# EAGLE design Domino JTAG SPI No Teardrop (EAGLE 6.5.0)
DATABASE: ./../Common/BOM/Domino_DB.txt; DRAWN: M.STEMPIN; REV: D
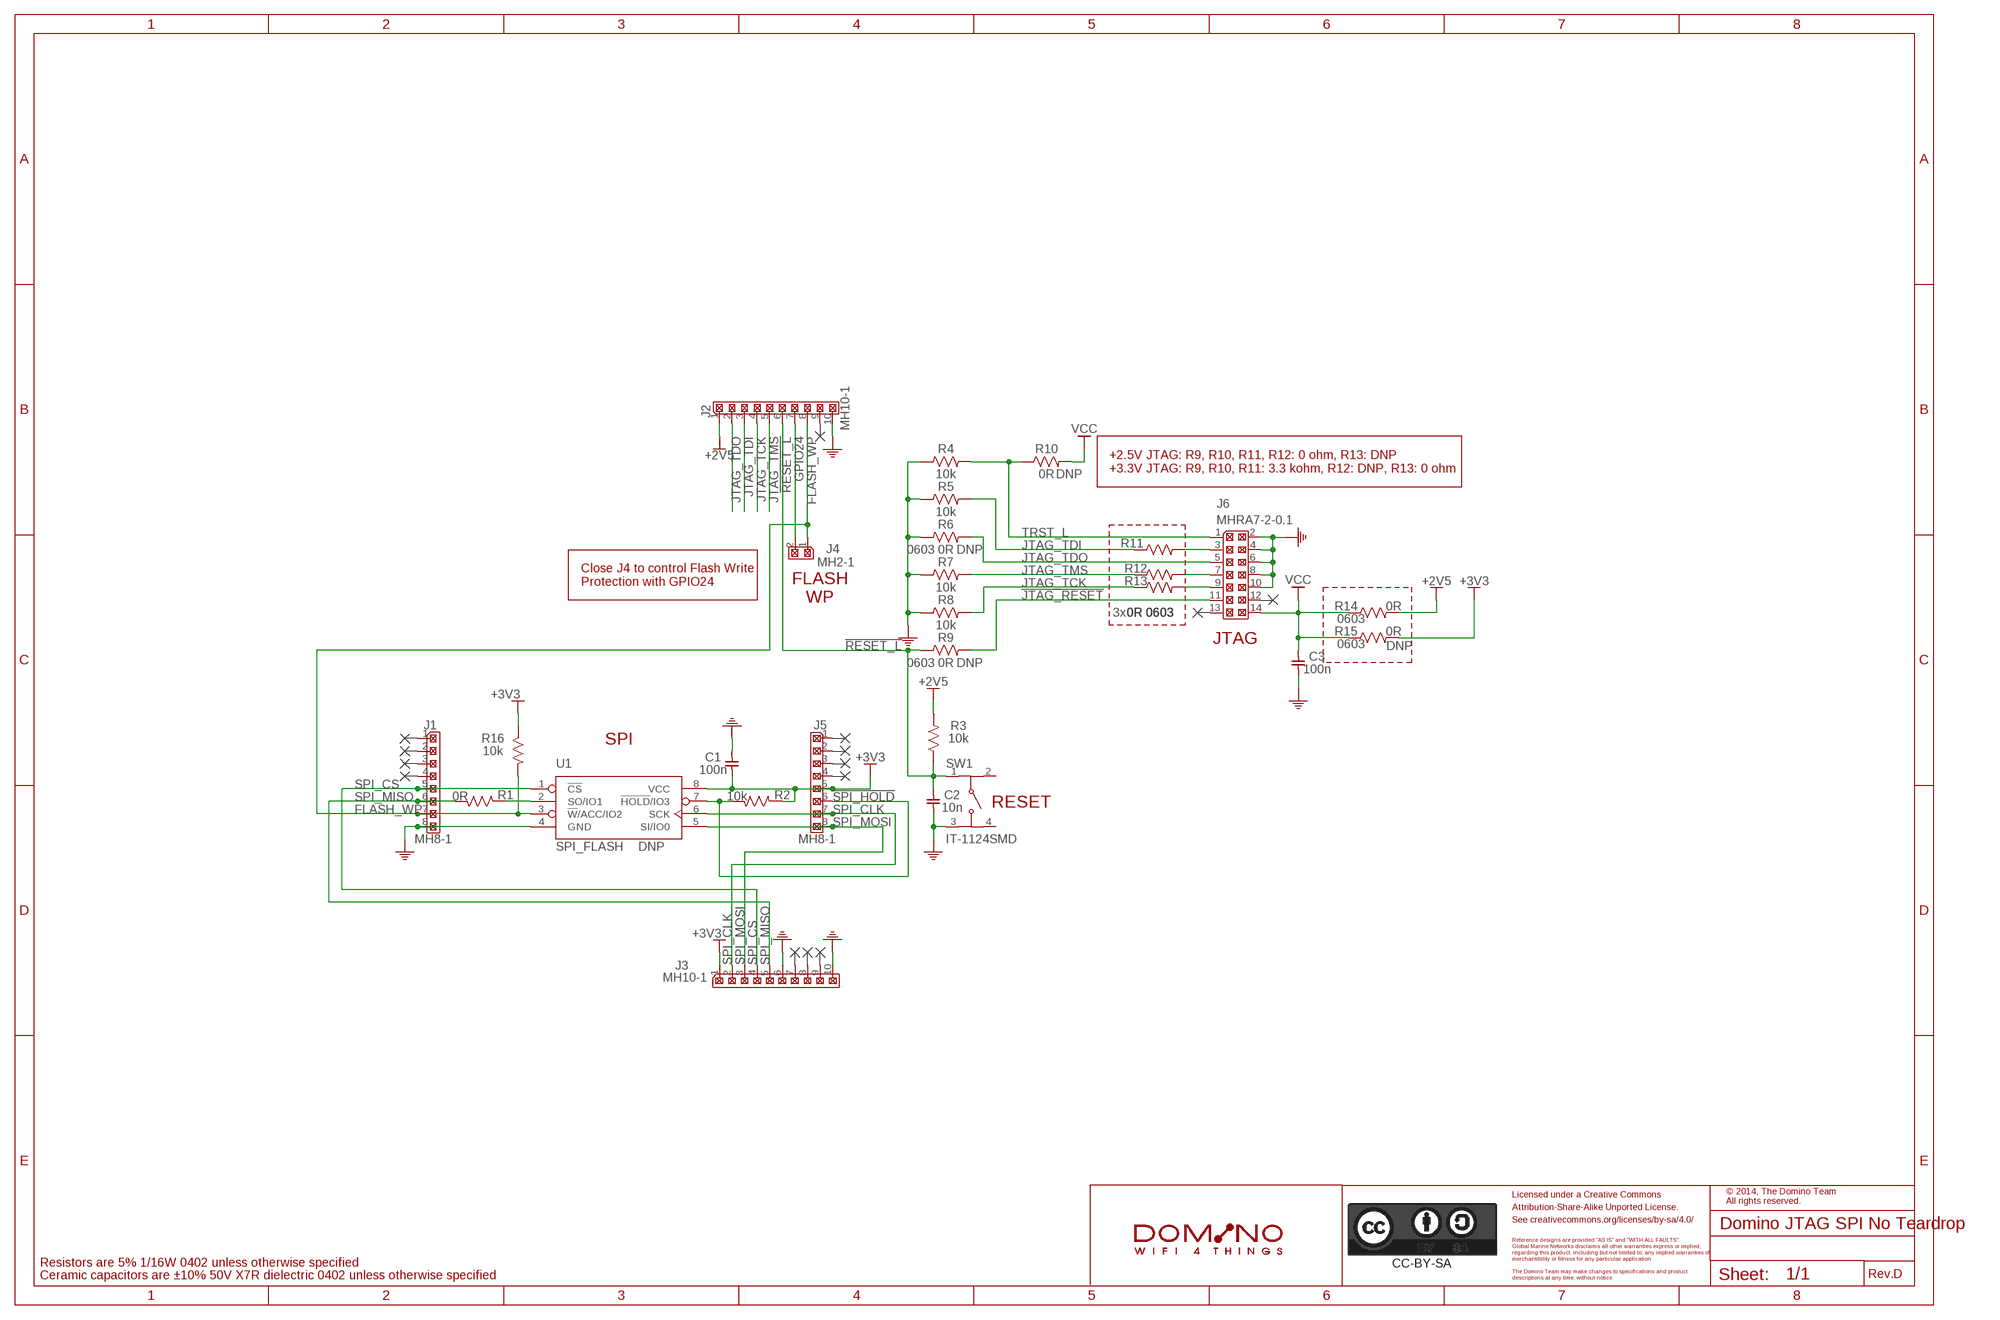
[diagram p0: schematic, sheet 1]
PORT1 (NC): BOM: EXCLUDE
PORT2 (NC): BOM: EXCLUDE
PORT3 (NC): BOM: EXCLUDE
PORT4 (NC): BOM: EXCLUDE
PORT5 (NC): BOM: EXCLUDE
PORT6 (NC): BOM: EXCLUDE
PORT7 (NC): BOM: EXCLUDE
PORT8 (NC): BOM: EXCLUDE
PORT10 (NC): BOM: EXCLUDE
PORT11 (NC): BOM: EXCLUDE
PORT12 (NC): BOM: EXCLUDE
PORT13 (NC): BOM: EXCLUDE
PORT14 (NC): BOM: EXCLUDE
PORT15 (NC): BOM: EXCLUDE

## Parts
C1  100n  CAP_0402  [C0402]
C2  10n  CAP_0402  [C0402]
C3  100n  CAP_0402  [C0402]
CC-BY-SA1  CC-BY-SA_LOGO  [CC-BY-SA_LOGO]
J1  MH8-1  [MH8-1-0.1]
J2  MH10-1  [MH10-1-0.1]
J3  MH10-1  [MH10-1-0.1]
J4  MH2-1  [MH2-1-0.1]
J5  MH8-1  [MH8-1-0.1]
J6  MHRA7-2-0.1  [MHRA7-2-0.1]
R1  0R  RES_0402  [R0402]
R2  10k  RES_0402  [R0402]
R3  10k  RES_0402  [R0402]
R4  10k  RES_0402  [R0402]
R5  10k  RES_0402  [R0402]
R6  0R  RES_0603  [R0603]
R7  10k  RES_0402  [R0402]
R8  10k  RES_0402  [R0402]
R9  0R  RES_0603  [R0603]
R10  0R  RES_0603  [R0603]
R11  0R  RES_0603  [R0603]
R12  0R  RES_0603  [R0603]
R13  0R  RES_0603  [R0603]
R14  0R  RES_0603  [R0603]
R15  0R  RES_0603  [R0603]
R16  10k  RES_0402  [R0402]
SW1  IT-1124SMD  [IT-1124SMD]
U1  SPI_FLASH  [SOIC-8]
U$2  DOMINO_LOGO  [DOMINO_LOGO]

## Nets
!JTAG_RESET: J6.11 R9.2
!RESET_L: C2.1 J2.6 R3.1 R9.1 SW1.1
!SPI_HOLD: J5.6 R2.2 U1.7(!HOLD!/IO3)
+2V5: J2.1 R3.2 R14.2
+3V3: C1.2 J3.1 J5.5 R2.1 R15.2 R16.1 U1.8(VCC)
FLASH_WP: J1.7 J2.8 J4.1 R16.2 U1.3(!W!/ACC/IO2)
GND: C1.1 C2.2 C3.2 J1.8 J2.10 J3.6 J3.10 J6.2 J6.4 J6.6 J6.8 J6.10 R4.1 R5.1 R6.1 R7.1 R8.1 SW1.3 U1.4(GND)
GPIO24: J2.7 J4.2
JTAG_TCK: J2.4 R8.2 R13.1
JTAG_TDI: J2.3 R5.2 R11.1
JTAG_TDO: J2.2 J6.5 R6.2
JTAG_TMS: J2.5 R7.2 R12.1
N$2: J6.7 R12.2
N$3: J6.9 R13.2
N$5: J6.3 R11.2
N$6: R1.1 U1.2(SO/IO1)
SPI_CLK: J3.2 J5.7 U1.6(SCK)
SPI_CS: J1.5 J3.4 U1.1(!CS)
SPI_MISO: J1.6 J3.5 R1.2
SPI_MOSI: J3.3 J5.8 U1.5(SI/IO0)
TRST_L: J6.1 R4.2 R10.1
VCC: C3.1 J6.14 R10.2 R14.1 R15.1
Unconnected: J1.1 J1.2 J1.3 J1.4 J2.9 J3.7 J3.8 J3.9 J5.1 J5.2 J5.3 J5.4 J6.12 J6.13 SW1.2 SW1.4

## Notes on the sheet
- +2.5V JTAG: R9, R10, R11, R12: 0 ohm, R13: DNP
  +3.3V JTAG: R9, R10, R11: 3.3 kohm, R12: DNP, R13: 0 ohm
- Close J4 to control Flash Write
  Protection with GPIO24
- FLASH
  WP
- 3x
- JTAG
- SPI
- RESET
- Licensed under a Creative Commons
- © 2014, The Domino Team
  All rights reserved.
- Attribution-Share-Alike Unported License.
- See creativecommons.org/licenses/by-sa/4.0/
- Reference designs are provided "AS IS" and "WITH ALL FAULTS".
- Global Marine Networks disclaims all other warranties express or implied,
- regarding this product, including but not limited to, any implied warranties of
- merchantibility or fitness for any particular application.
- Resistors are 5% 1/16W 0402 unless otherwise specified
- The Domino Team may make changes to specifications and product
- Ceramic capacitors are ±10% 50V X7R dielectric 0402 unless otherwise specified | descriptions at any time, without notice. | Rev.

## Library data of the parts
C1 C3 = Domino:CAP_: Capacitor; PARTNO: C0402_100n_X7R_10%_CER_50V; SIZE: 0402; TC: X7R; TOL: ±10%; TYPE: CER; VOLT: 50V
C2 = Domino:CAP_: Capacitor; PARTNO: C0402_10n_X7R_10%_CER_50V; SIZE: 0402; TC: X7R; TOL: ±10%; TYPE: CER; VOLT: 50V
CC-BY-SA1 = Domino:CC-BY-SA_LOGO: Attribution-Share-Alike Unported License See creativecommons.org/licenses/by-sa/3.0/ for details.; BOM: EXCLUDE
J1 J5 = Domino:MH8-1: 8x1 Pin Male Header; PARTNO: MH8-1-0.1
J2 J3 = Domino:MH10-1: 10x1 Pin Male Header; PARTNO: MH10-1-0.1
J4 = Domino:MH2-1: 2x1 Pin Male Header; PARTNO: MH2-1-0.1
J6 = Domino:MHRA7-2-0.1: 2x14 Pin Male Header Right Angle with Sleeve, 0.1" Pitch; PARTNO: MHRA7-2-0.1
R1 = Domino:RES_: Resistor; PARTNO: R0402_0R_5%_62.5mW; RATE: 62.5mW; SIZE: 0402; TOL: 5%
R2-R5 R7 R8 R16 = Domino:RES_: Resistor; PARTNO: R0402_10k_5%_62.5mW; RATE: 62.5mW; SIZE: 0402; TOL: 5%
R6 R9 R10 R15 = Domino:RES_: Resistor; DNP: T; PARTNO: R0603_0R_5%_125mW; RATE: 125mW; SIZE: 0603; TOL: 5%
R11-R14 = Domino:RES_: Resistor; PARTNO: R0603_0R_5%_125mW; RATE: 125mW; SIZE: 0603; TOL: 5%
SW1 = Domino:IT-1124SMD: SPST Tact Switch; PARTNO: IT-1124SMD
U1 = Domino:SPI_FLASH: SPI Flash Memory Footprint; DNP: T; PARTNO: SPI_FLASH
U$2 = Domino:DOMINO_LOGO: Domino Logo; BOM: EXCLUDE

## Net classes
1 USB: width 0.254 mm, clearance 0.127 mm
2 PoE: width 0.61 mm, clearance 0.13 mm to class 0, clearance 0.13 mm to class 1, clearance 0.13 mm

## Board
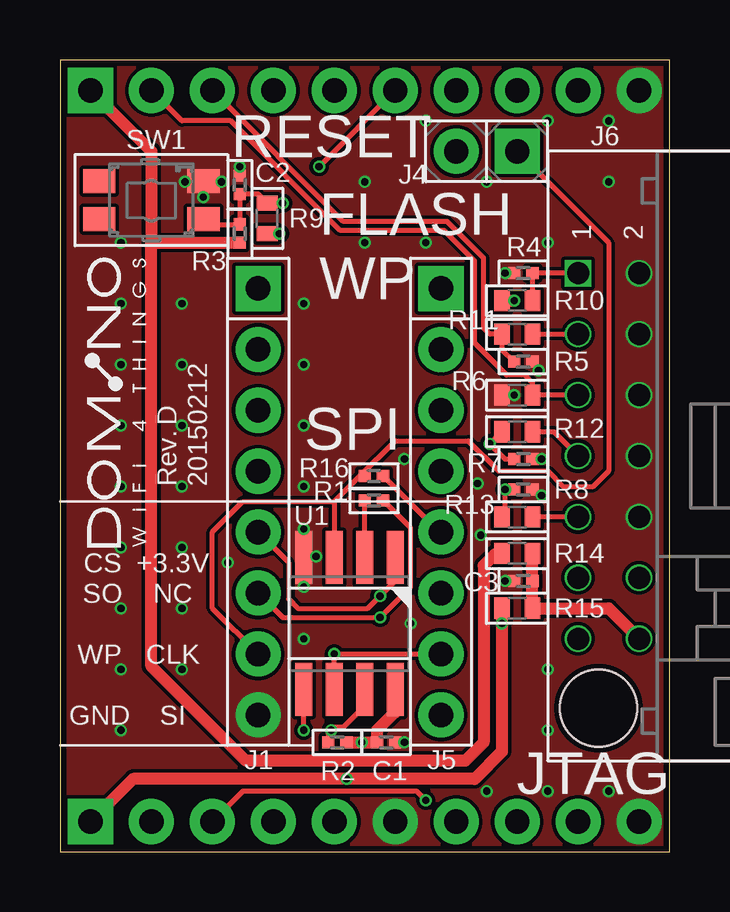
[diagram p1: board, top side]
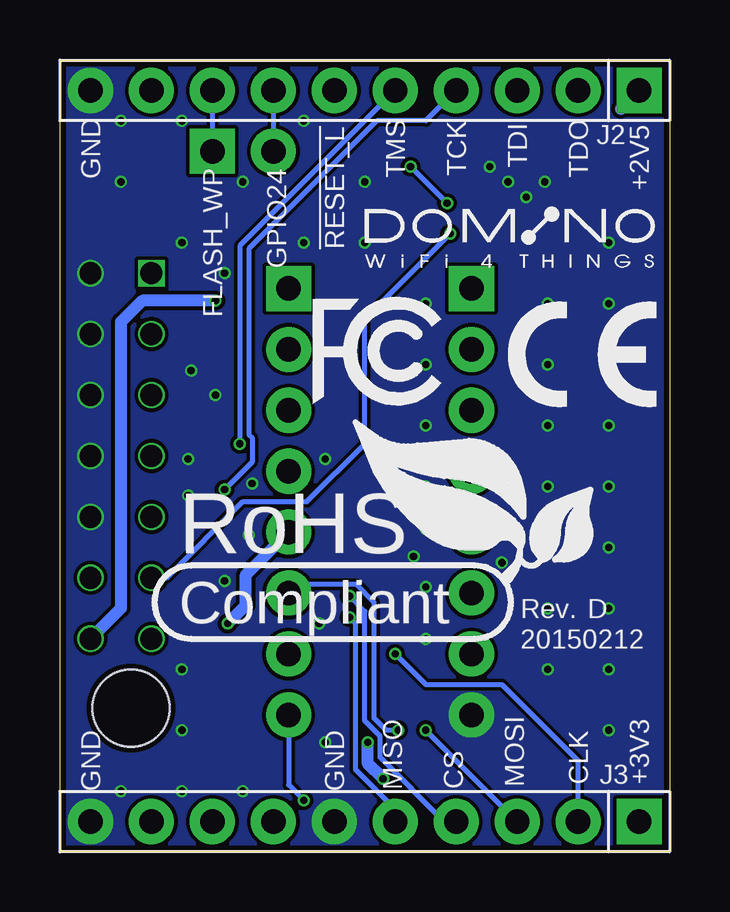
[diagram p2: board, bottom side, seen from below]

Size 25.4 x 33.02 mm. Coordinates in mm from the lower left corner, seen from the top.
Outline: 0,0 25.4,0 25.4,33.02 0,33.02 0,0
Copper layers (1*16): Top 0.043mm / dielectric 1mm / Bottom 0.043mm
Design rules "Domino": minimum track width 0.1mm, minimum drill 0.3mm, track to track 6mil, track to pad 6mil, pad to pad 6mil, via to via 6mil, smd to smd 0mil, copper to edge 0.25mm, drill to drill 0.35mm, minimum pad ring 0.085mm, minimum via ring 0.1mm, stop-mask expansion 0mil, vias tented up to drill 0.45mm, thermal gap 0.2mm
Holes 3.2 mm at 22.44,6

### Footprints (pad centres in the part's own frame; a part is rotated, then mirrored left to right if it is on the bottom)
C0402 = smd 0.508 x 0.508: 1 -0.381,0; 2 0.381,0
MH8-1-0.1 = drill 1.016 pad 1.88 square: 1 0,0 | drill 1.016 pad 1.88: 2 2.54,0; 3 5.08,0; 4 7.62,0; 5 10.16,0; 6 12.7,0; 7 15.24,0; 8 17.78,0
MH10-1-0.1 = drill 1.016 pad 1.88 square: 1 0,0 | drill 1.016 pad 1.88: 2 2.54,0; 3 5.08,0; 4 7.62,0; 5 10.16,0; 6 12.7,0; 7 15.24,0; 8 17.78,0; 9 20.32,0; 10 22.86,0
MH2-1-0.1 = drill 1.016 pad 1.88 square: 1 0,0 | drill 1.016 pad 1.88: 2 2.54,0
MHRA7-2-0.1 = drill 0.914 square: 1 -7.62,-1.27 | drill 0.914: 2 -7.62,1.27; 3 -5.08,-1.27; 4 -5.08,1.27; 5 -2.54,-1.27; 6 -2.54,1.27; 7 0,-1.27; 8 0,1.27; 9 2.54,-1.27; 10 2.54,1.27; 11 5.08,-1.27; 12 5.08,1.27; 13 7.62,-1.27; 14 7.62,1.27
R0402 = smd 0.508 x 0.508: 1 -0.381,0; 2 0.381,0
R0603 = smd 0.635 x 0.889: 1 -0.635,0; 2 0.635,0
IT-1124SMD = smd 1.35 x 1: 1 -2.175,0.8; 2 2.175,0.8; 3 -2.175,-0.8; 4 2.175,-0.8
SOIC-8 = smd 0.7 x 2.2: 1 -1.905,-2.75; 2 -0.635,-2.75; 3 0.635,-2.75; 4 1.905,-2.75; 5 1.905,2.75; 6 0.635,2.75; 7 -0.635,2.75; 8 -1.905,2.75

### Placement (x,y rotation side)
C1  13.59,4.57 180 top
C2  7.49,27.81 90 top
C3  19.3,11.3 180 top
CC-BY-SA1  -5.08,-50.8 0 top  (outside the outline)
DRILEGEND  [DRILEGEND]  81.53,59.94 0 top  (outside the outline)
J1  8.26,23.5 270 top
J2  1.27,31.75 180 bottom
J3  1.27,1.27 180 bottom
J4  19.05,29.21 180 top
J5  15.88,23.5 270 top
J6  22.86,16.51 270 top
R1  13.08,14.66 0 top
R2  11.56,4.57 180 top
R3  7.49,25.78 270 top
R4  19.3,24.13 0 top
R5  19.3,20.45 180 top
R6  19.05,19.05 0 top
R7  19.3,16.38 180 top
R8  19.3,15.11 180 top
R9  8.64,26.42 270 top
R10  19.05,22.99 180 top
R11  19.05,21.59 0 top
R12  19.05,17.53 0 top
R13  19.05,13.97 0 top
R14  19.05,12.45 180 top
R15  19.05,10.16 180 top
R16  13.08,15.67 180 top
SW1  3.81,27.18 180 top
U1  12.06,9.53 180 top
U$2  -44.45,-48.26 0 top  (outside the outline)
U$3  [A5L-LOC]  -55.88,-62.23 0 top  (outside the outline)
U$6  [ROHS_LOGO]  20.45,9.53 0 bottom
U$8  [CE_LOGO_SMALL]  6.73,18.54 0 bottom
U$10  [FCC_LOGO_SMALL]  14.86,18.67 0 bottom
U$11  [DOMINO_LOGO_SMALL]  2.54,12.7 90 top
U$12  [DOMINO_LOGO_SMALL]  12.7,25.4 0 bottom

### Tracks (layer width: path | path; a pad name or v marks a point on that pad's centre or on a via)
!JTAG_RESET  (via drill 0.3)
  Top 0.203: v9.14,25.78 R9.2
  Bottom 0.203: J6.11 20.95,11.43 17.78,14.61 15.11,14.61 12.7,17.02 12.7,22.23 v9.14,25.78
!RESET_L  (via drill 0.3)
  Top 0.203: SW1.1 6.02,26.42 6.28,26.16 R3.1 C2.1 8.26,27.43 R9.1 v9.27,27.05 | J2.6 v10.79,28.57
  Bottom 0.203: v10.79,28.57 v9.27,27.05
!SPI_HOLD  (via drill 0.3)
  Top 0.203: U1.7 12.7,6.1 11.81,5.21 11.43,5.21 v11.3,5.08 11.18,4.95 R2.2
  Bottom 0.203: J5.6 15.49,11.18 13.08,11.18 12.32,10.41 12.32,5.59 11.81,5.08 v11.3,5.08
+2V5
  Top 0.508: J2.1 3.81,29.21 3.81,25.4 | 3.81,25.4 R3.2 | R14.2 18.16,12.45 17.65,11.94 17.65,4.57 16.89,3.81 7.75,3.81 3.81,7.75 3.81,25.4
  Bottom 0.508: 2.03,30.99 J2.1
+3V3  (via drill 0.3)
  Top 0.203: J5.5 15.8,13.34 R16.1
  Top 0.508: J3.1 3.05,3.05 v11.94,3.05 17.27,3.05 18.41,4.19 v18.41,9.53 R15.2 | R2.1 v12.57,4.57 C1.2 13.21,5.08 13.97,5.84 U1.8
  Bottom 0.508: v18.41,9.53 17.65,10.29 17.65,11.56 J5.5 | v11.94,3.05 12.57,3.68 v12.57,4.57
FLASH_WP
  Top 0.203: J4.1 22.86,25.4 22.86,15.88 22.23,15.24 20.95,15.24 20.32,15.88 18.29,15.88 17.02,17.14 13.97,17.14 12.5,15.67 | 11.43,14.61 U1.3 11.43,12.06 | J1.7 6.35,10.16 6.35,13.34 7.62,14.61 11.43,14.61 | R16.2 12.5,15.67 | 12.5,15.67 11.43,14.61
  Bottom 0.203: J2.8 J4.1
GND  (via drill 0.3)
  other vias: 18.54,11.3 6.73,27.94 20.32,25.4 18.92,19.05 18.54,24.13 19.94,20.07 20.07,16.38 20.07,14.86 7.49,28.57 5.21,27.94 5.97,27.3 12.7,27.94 17.78,27.94 22.86,30.48 20.32,30.48 15.24,30.48 22.86,27.94 15.24,25.4 12.7,25.4 2.54,25.4 2.54,22.86 5.08,22.86 10.16,22.86 10.16,20.32 5.08,20.32 2.54,20.32 2.54,17.78 2.54,15.24 2.54,12.7 2.54,10.16 2.54,5.08 5.08,12.7 5.08,15.24 5.08,17.78 10.16,17.78 10.16,15.24 20.32,7.62 20.32,5.08 20.32,2.54 22.86,2.54 17.78,2.54 5.08,10.16 5.08,7.62 2.54,7.62 14.35,4.57 10.16,13.46 10.16,11.05 10.67,12.32 6.99,12.06 10.16,8.89 14.61,9.53 17.4,15.37 17.53,13.21 14.35,16.38
  pour Top (no thermals): 0,33.02 25.4,33.02 25.4,0 0,0
  pour Bottom (no thermals): 0,33.02 25.4,33.02 25.4,0 0,0
GPIO24
  Bottom 0.203: J2.7 J4.2
JTAG_TCK  (via drill 0.3)
  Top 0.203: R8.2 v18.54,15.11 18.54,13.84 R13.1
  Bottom 0.203: J2.4 10.16,30.48 12.19,30.48 17.53,25.15 17.53,17.4 17.4,17.27 17.4,16.26 v18.54,15.11
JTAG_TDI
  Top 0.203: R5.2 18.41,20.95 R11.1 17.91,21.59 17.65,21.84 17.65,24.77 16.13,26.29 11.81,26.29 J2.3
JTAG_TDO
  Top 0.203: J6.5 R6.2 19.68,19.56 19.37,19.88 18.61,19.88 17.27,21.21 17.27,24.64 16,25.91 11.68,25.91 7.11,30.48 5.08,30.48 J2.2
JTAG_TMS  (via drill 0.3)
  Top 0.203: R12.1 v17.91,17.02 18.54,16.38 R7.2
  Bottom 0.203: J2.5 17.91,25.27 v17.91,17.02
N$2
  Top 0.203: R12.2 20.57,17.53 J6.7
N$3
  Top 0.203: J6.9 R13.2
N$5
  Top 0.203: R11.2 J6.3
N$6
  Top 0.203: U1.2 R1.1
SPI_CLK  (via drill 0.3)
  Top 0.203: J5.7 v11.43,8.26 U1.6
  Bottom 0.203: J3.2 3.81,3.81 6.99,6.99 10.16,6.99 v11.43,8.26
SPI_CS  (via drill 0.3)
  Top 0.203: U1.1 13.97,11.3 v13.34,10.67 12.83,10.16 9.91,10.16 9.53,10.54 9.53,12.06 J1.5
  Bottom 0.203: v13.34,10.67 12.7,10.03 12.7,5.46 12.06,4.83 12.06,3.94 9.4,1.27 J3.4
SPI_MISO  (via drill 0.3)
  Top 0.203: J1.6 9.27,9.78 v13.34,9.78 14.61,11.05 14.61,13.51 R1.2
  Bottom 0.203: J3.5 11.43,1.78 13.08,3.43 13.08,9.53 v13.34,9.78
SPI_MOSI  (via drill 0.3)
  Top 0.203: v10.16,5.08 U1.5 | v15.24,2.16 14.86,2.54 7.62,2.54 J3.3
  Bottom 0.203: J3.3 v10.16,5.08 | J5.8 15.88,2.79 v15.24,2.16
TRST_L
  Top 0.203: R10.1 R4.2 J6.1
VCC  (via drill 0.3)
  Top 0.508: J6.14 22.86,10.16 R15.1 C3.1 R14.1 | R10.2 v18.92,22.99
  Bottom 0.508: J6.14 22.86,10.16 22.86,22.1 21.97,22.99 v18.92,22.99

### Text on the board
tPlace: RESET | FLASH / WP | SPI | CS | +3.3V | SO | NC | WP | CLK | GND | SI | JTAG
bPlace: +2V5 | TDO | TDI | TCK | TMS | GND | !RESET_L | GPIO24 | FLASH_WP | +3V3 | CLK | MOSI | MISO | GND | GND | CS
tNames: Rev.
bNames: Rev.
Document: DRILL CHART: TOP TO BOTTOM | STACK-UP FOR REFERENCE | LAYER 1 L1 TOP | 18 UM CU + 12.5 UM PLATING (30.5 UM) | 1.061 MM+/-10% | CORE | 1.0 MM CORE FR-4 LG 135 / INCLUDING COPPER | LAYER 4 L16 BOTTOM | 18 UM CU + 12.5 UM PLATING (30.5 UM) | NOTES: | 1. PRINTED CIRCUIT BOARD MADE FROM NEMA GRADE FR-4 TG 135 EPOXY / LAMINATE WITH 18 UM COPPER PLATING AND 1 MM THICKNESS. | 2. ALL DIMENSIONS ARE GIVEN IN MILLIMETERS EXCEPT TRACE WIDTH/SPACE. | 3. CIRCUIT PATHS ARE FOR REFERENCE ONLY. | 4. HOLE SIZES SHOWN ARE FINISHED DIAMETERS AFTER PLATING. | 5. BOARD PLATED USING REFLOW OR SIMILAR METHOD. | 6. BOARD TO HAVE WHITE SOLDER MASK ON PLATED SURFACES USING WET / FILM SR100 OR SR1010 EPOXY. / EQUIVALENT WET OR DRY FILM MAY BE USED. | 7. SILKSCREEN BOARD USING BLACK INK. DISTORTION OF SILKSCREEN / IS ACCEPTABLE OVER TRACES. EPOXY INK ON PLATED LANDS IS NOT / ACCEPTABLE | 8. THE FOLLOWING INFORMATION APPLIES TO THIS BOARD: | * 2 COPPER LAYERS | * 1 MM BOARD THICKNESS | * REQUIRES TOP AND BOTTOM SIDE SILKSCREENS | © 2014, The Domino Team. / All rights reserved. | Licensed under a Creative Commons / Attribution-Share-Alike Unported License. / See creativecommons.org/licenses/by-sa/4.0/ | Reference designs are provided "AS IS" and "WITH ALL FAULTS". / The Domino Team disclaims all other warranties express or implied, / regarding this product, including but not limited to, any implied warranties of / merchantibility or fitness for any particular application. | The Domino Team may make changes to specifications and product descriptions / at any time, without notice. | Rev.
DrillLegend: LAYER-STACK
DrillLegend_01-16: 01-16
DrillLegend_01-20: 01-20
Pinout: +2V5 | JTAG_TDO | JTAG_TDI | JTAG_TCK | JTAG_TMS | !RESET_L | GPIO24 | FLASH_WP | GND | +3V3 | SPI_CLK | SPI_MOSI | SPI_CS | SPI_MISO | GND | GND | Pinout (.PIN)
Component_side: Component Side (.CMP)
Solder_side: Solder side (.SOL)
Silk_screen_CMP: Silk screen CMP (.PLC)
Silk_screen_SOL: Silk screen SOL (.PLS)
Solder_stop_mask_CMP: Solder stop mask CMP (.STC)
Solder_stop_mask_SOL: Solder stop mask SOL (.STS)
Cream_frame_CMP: Cream frame CMP (.CRC)
Cream_frame_SOL: Cream frame SOL (.CRS)
Drill_data: Drill data (.DRD)
Component_Assembly_CMP: Component Assembly CMP (.ASC)
Component_Assembly_SOL: Component Assembly SOL (.ASS)
Outline: Outline (.OLN)